# EAGLE design sensor_006 (EAGLE 4.16)
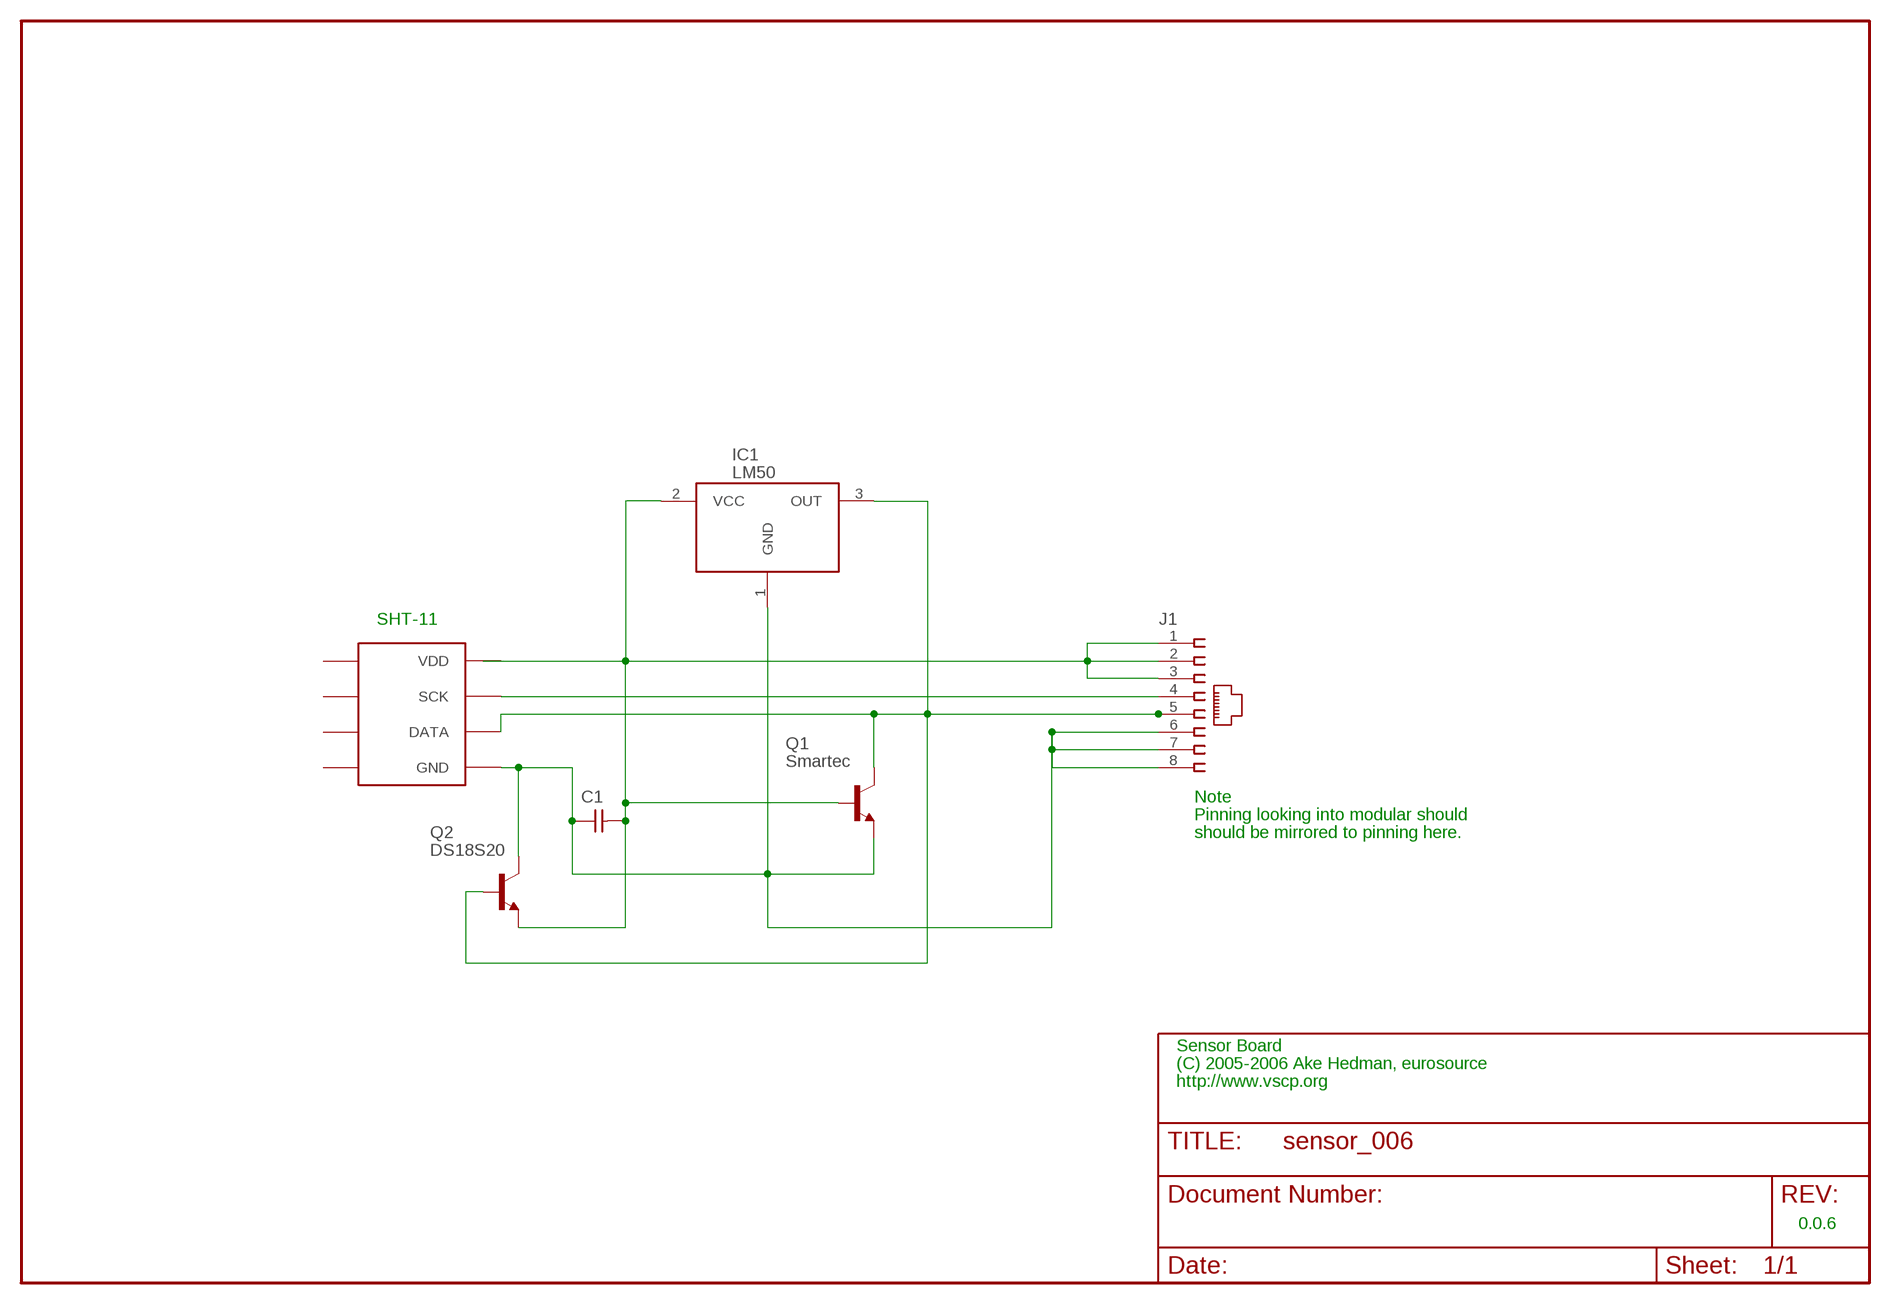
[diagram p0: schematic, sheet 1]

## Parts
C1  CAPNP-5  [C-5]
IC1  LM50  [SOT23]
J1  215877-4  [215877-4]
Q1  Smartec  BC548  [TO92-EBC]
Q2  DS18S20  BC548  [TO92-EBC]
SHT1  SHT11  [SHT11]

## Nets
GND: C1.1 IC1.1(GND) J1.6 J1.7 J1.8 Q1.E Q2.C SHT1.GND
N$4: IC1.3(OUT) J1.5 Q1.C Q2.B SHT1.DATA
SCK: J1.4 SHT1.SCK
VDD: C1.2 IC1.2(VCC) J1.1 J1.2 J1.3 Q1.B Q2.E
Unconnected: SHT1.5 SHT1.6 SHT1.7 SHT1.8

## Notes on the sheet
- SHT-11
- Note
- Pinning looking into modular should
- should be mirrored to pinning here.
- Sensor Board
- (C) 2005-2006 Ake Hedman, eurosource
- http://www.vscp.org
- 0.0.6

## Power pins joined to a net without a drawn wire
VDD: SHT1.VDD

## Library data of the parts
C1 = discrete:CAPNP-5
IC1 = eurosource:LM50
J1 = con-amp:215877-4: AMP connector
Q1 Q2 = transistor-npn:BC548*: NPN Transistor
SHT1 = sht11:SHT11

## Board
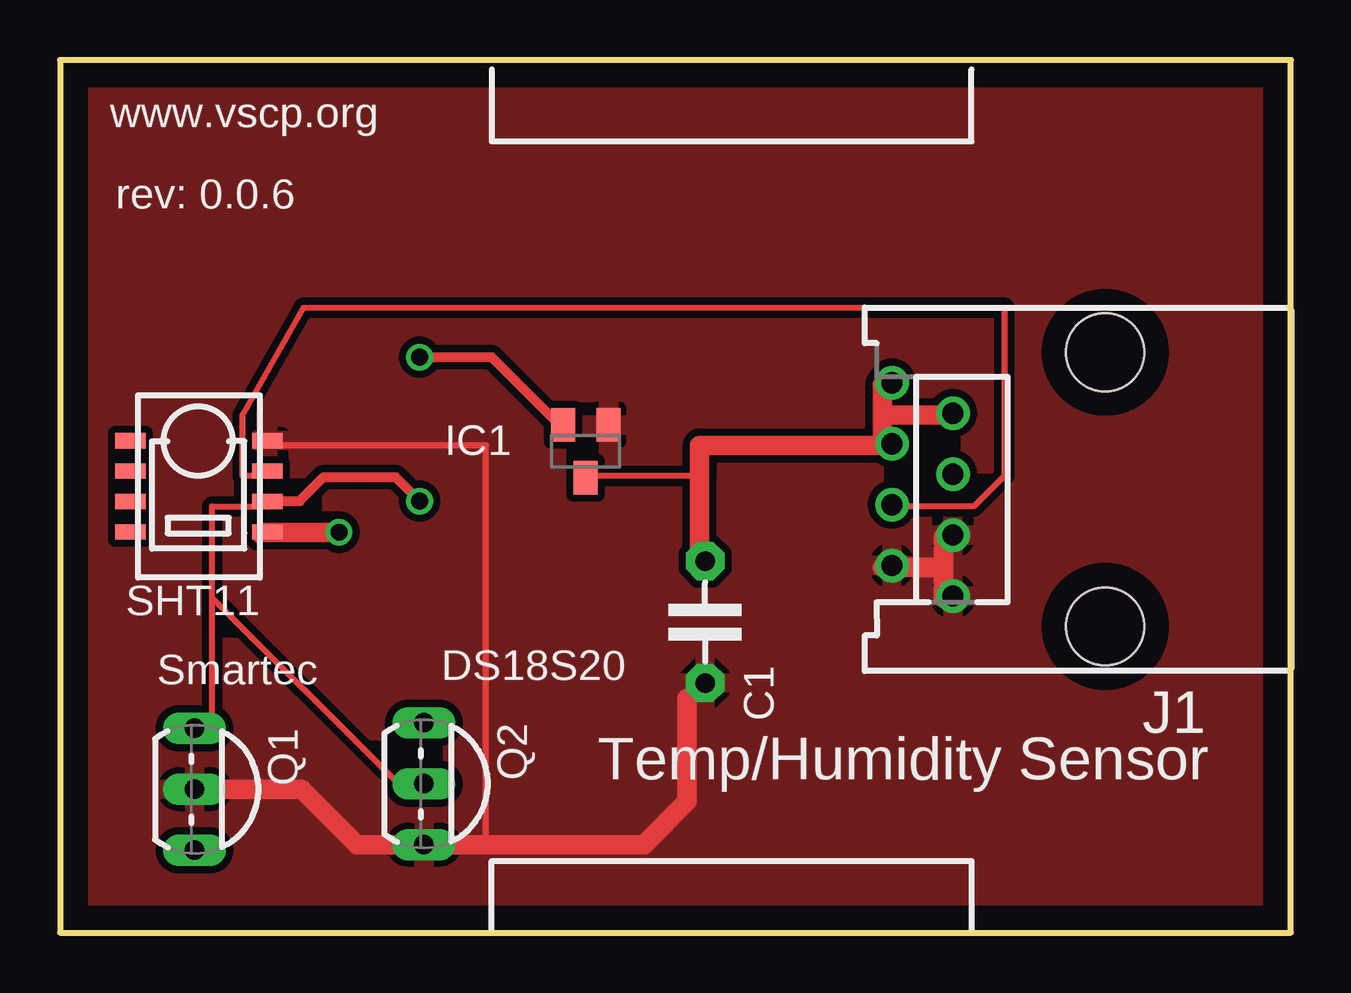
[diagram p1: board, top side]
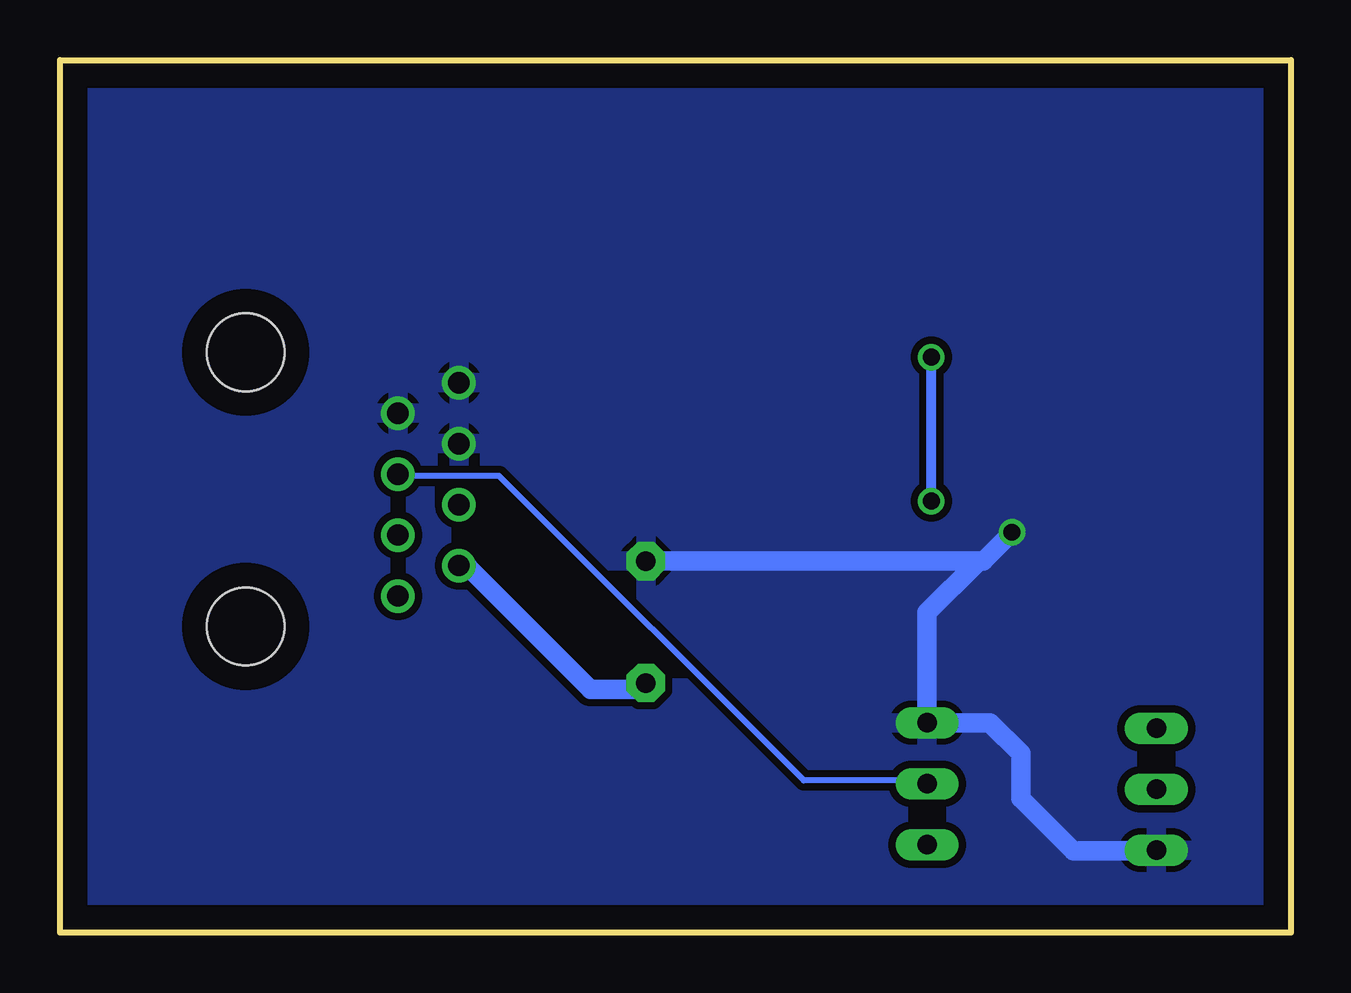
[diagram p2: board, bottom side, seen from below]

Size 51.31 x 36.38 mm. Coordinates in mm from the lower left corner, seen from the top.
Outline: 0,0 51.31,0 51.31,36.38 0,36.38 0,0
Copper layers (1*16): Top 0.035mm / dielectric 1.5mm / Bottom 0.035mm
Design rules "10mils": minimum track width 10mil, minimum drill 24mil, track to track 10mil, track to pad 10mil, pad to pad 10mil, via to via 10mil, smd to smd 10mil, copper to edge 40mil, drill to drill 10mil, minimum pad ring 10mil, minimum via ring 8mil, stop-mask expansion 0mil, vias tented up to drill 0mil, thermal gap 10mil

### Footprints (pad centres in the part's own frame; a part is rotated, then mirrored left to right if it is on the bottom)
C-5 = drill 0.813 pad 1.6 octagon: 1 -2.54,0; 2 2.54,0
SOT23 = smd 1 x 1.4: 1 0,1.1; 2 -0.95,-1.1; 3 0.95,-1.1
215877-4 = drill 0.889 round: 1 -4.445,6.35; 2 -3.175,8.89; 3 -1.905,6.35; 4 -0.635,8.89; 5 0.635,6.35; 6 1.905,8.89; 7 3.175,6.35; 8 4.445,8.89 | hole 3.251: -5.715,0; 5.715,0
TO92-EBC = drill 0.813 long: B 0,-1.27; C -2.54,-1.27; E 2.54,-1.27
SHT11 = smd 1.27 x 0.635: 5 7.31,2.54; 6 7.31,3.81; 7 7.31,5.08; 8 7.31,6.35; DATA 1.59,5.08; GND 1.59,6.35; SCK 1.59,3.81; VDD 1.59,2.54

### Placement (x,y rotation side)
C1  26.89,12.95 270 top
IC1  21.91,20.07 180 top
J1  43.57,18.48 90 top
Q1  6.88,5.98 270 top
Q2  16.44,6.21 270 top
SHT1  10.24,23.05 180 top

### Tracks (layer width: path | path; a pad name or v marks a point on that pad's centre or on a via)
GND  (via drill 0.7)
  Top 0.254: C1.1 26.66,15.23 | 26.66,19.04 21.58,19.04 IC1.1
  Top 0.406: SHT1.GND 8.53,16.7 8.52,16.69 8.27,16.44 | 36.82,21.58 J1.7 | 34.28,20.31 J1.6
  Top 0.813: v11.63,16.69 8.52,16.69 | 34.28,21.58 34.28,22.85 J1.8 | 34.28,21.58 34.28,20.31 26.66,20.31 26.66,19.04 26.66,15.23 | 34.28,21.58 36.82,21.58
  Bottom 0.406: 13.07,15.44 13.07,15.49 | 5.32,3.44 5.28,3.48 | Q1.E 5.32,3.44 | 5.32,3.44 5.34,3.42
  Bottom 0.813: C1.1 13.07,15.49 12.83,15.49 v11.63,16.69 | 13.07,15.44 15.17,13.34 Q2.C 12.54,8.75 11.26,7.47 11.26,5.6 9.08,3.42 5.34,3.42
  pour Bottom (isolate 0.305): 0.75,0.89 50.4,0.89 50.4,1.31 50.26,1.31 50.26,35.61 1.03,35.61 1.03,35.4
N$4  (via drill 0.7)
  Top 0.254: 6.34,13.96 6.34,8.88 Q1.C | 6.34,13.96 6.34,17.77 8.88,17.77 SHT1.DATA | 6.34,13.96 13.96,6.34 Q2.B
  Top 0.406: SHT1.DATA 8.97,17.97 8.99,17.99 9.99,17.99 10.99,18.99 13.99,18.99 v14.99,17.99 | 20.96,21.02 20.99,20.99 | 20.96,21.02 IC1.3 | v14.99,23.99 17.99,23.99 20.96,21.02
  Bottom 0.254: J1.5 36.82,19.04 33.01,19.04 20.31,6.34 15.23,6.34 Q2.B
  Bottom 0.406: v14.99,17.99 v14.99,23.99
SCK
  Top 0.254: SHT1.SCK 8.88,19.04 7.61,19.04 7.61,21.58 10.15,26.05 39.36,26.05 39.36,19.04 38.09,17.77 34.28,17.77 J1.4
VDD
  Top 0.254: J1.2 34.28,15.23 | SHT1.VDD 8.88,20.31 17.77,20.31 17.77,3.67
  Top 0.406: 5.47,5.98 5.35,6.1 | Q1.B 5.47,5.98 | 5.47,5.98 5.48,5.97 | C1.2 26.89,10.52 26.14,9.77
  Top 0.813: 5.48,5.97 10.08,5.97 12.38,3.67 Q2.E 17.77,3.67 24.34,3.67 26.14,5.47 26.14,9.77 | 36.82,15.23 36.82,16.5 J1.3 | 36.82,15.23 36.82,13.96 J1.1 | 34.28,15.23 36.82,15.23
  Bottom 0.254: 34.28,15.23 J1.2
  Bottom 0.406: C1.2 26.66,10.15
  Bottom 0.813: 34.28,15.23 29.2,10.15 26.66,10.15
  pour Top (isolate 0.305): 0.95,35.38 0.67,35.38 0.67,0.95 50.69,0.95 50.69,1.42 50.55,1.42 50.55,35.86 1.08,35.86 1.08,35.45

### Text on the board
tNames: www.vscp.org | rev: 0.0.6 | Temp/Humidity Sensor